# Altium schematic sheet Rangkaian_Relay.SchDoc
size A
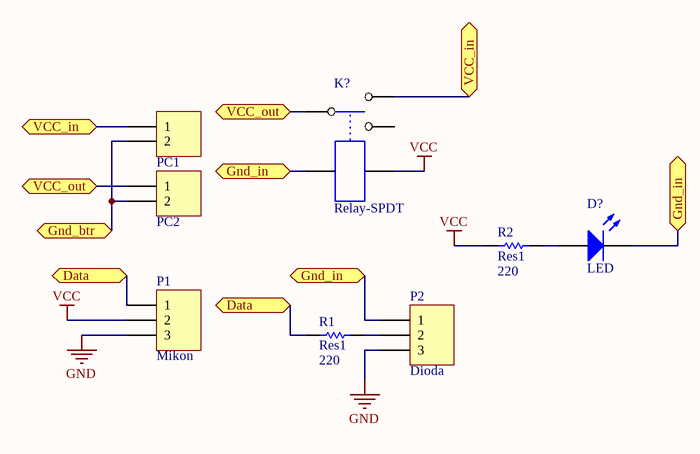
[diagram p0: Rangkaian_Relay.SchDoc]

## Parts
D?  LED  [My_LED3MM]
K?  Relay-SPDT  [My_rel]
P1  Mikon  [HDR1X3]
P2  Dioda  [HDR1X3]
PC1  Power Connector  [My_ Power_Connector]  (value not drawn)
PC2  Power Connector  [My_ Power_Connector]  (value not drawn)
R1  Res1  value 220  [AXIAL-0.3]
R2  Res1  value 220  [AXIAL-0.3]

## Ports
Data, Gnd_btr, Gnd_in, VCC_in, VCC_out

## Nets
GND: P1.3 P2.3
VCC: K?.5 P1.2 R2.1
Data: P1.1 R1.1 ; port Data
Gnd_btr: PC1.2 PC2.2 ; port Gnd_btr
Gnd_in: D?.K K?.4 P2.1 ; port Gnd_in
VCC_in: K?.2 PC1.1 ; port VCC_in
VCC_out: K?.1 PC2.1 ; port VCC_out
NetD?_A: D?.A R2.2
NetP2_2: P2.2 R1.2

Not connected (* = marked no-connect by the designer): K? 3

## Library data of the parts
D? = LED: Typical INFRARED GaAs LED; Published: 8-Jun-2000; LatestRevisionDate: 08-Jul-2005; LatestRevisionNote: Mech Layer 1 removed.; Publisher: Altium Limited
K? = Relay-SPDT: standard single contact relay
P1 P2 = Header 3: Header, 3-Pin; LatestRevisionDate: 17-Jul-2002; LatestRevisionNote: Re-released for DXP Platform.; Publisher: Altium Limited
PC1 PC2 = Power Connector: white Power Connector
R1 R2 = Res1: Resistor; Published: 8-Jun-2000; LatestRevisionDate: 17-Jul-2002; LatestRevisionNote: Re-released for DXP Platform.; PackageReference: AXIAL-0.3; Publisher: Altium Limited